# Altium schematic sheet charger.SchDoc
size A2; SheetNumber: 1; SheetTotal: 1
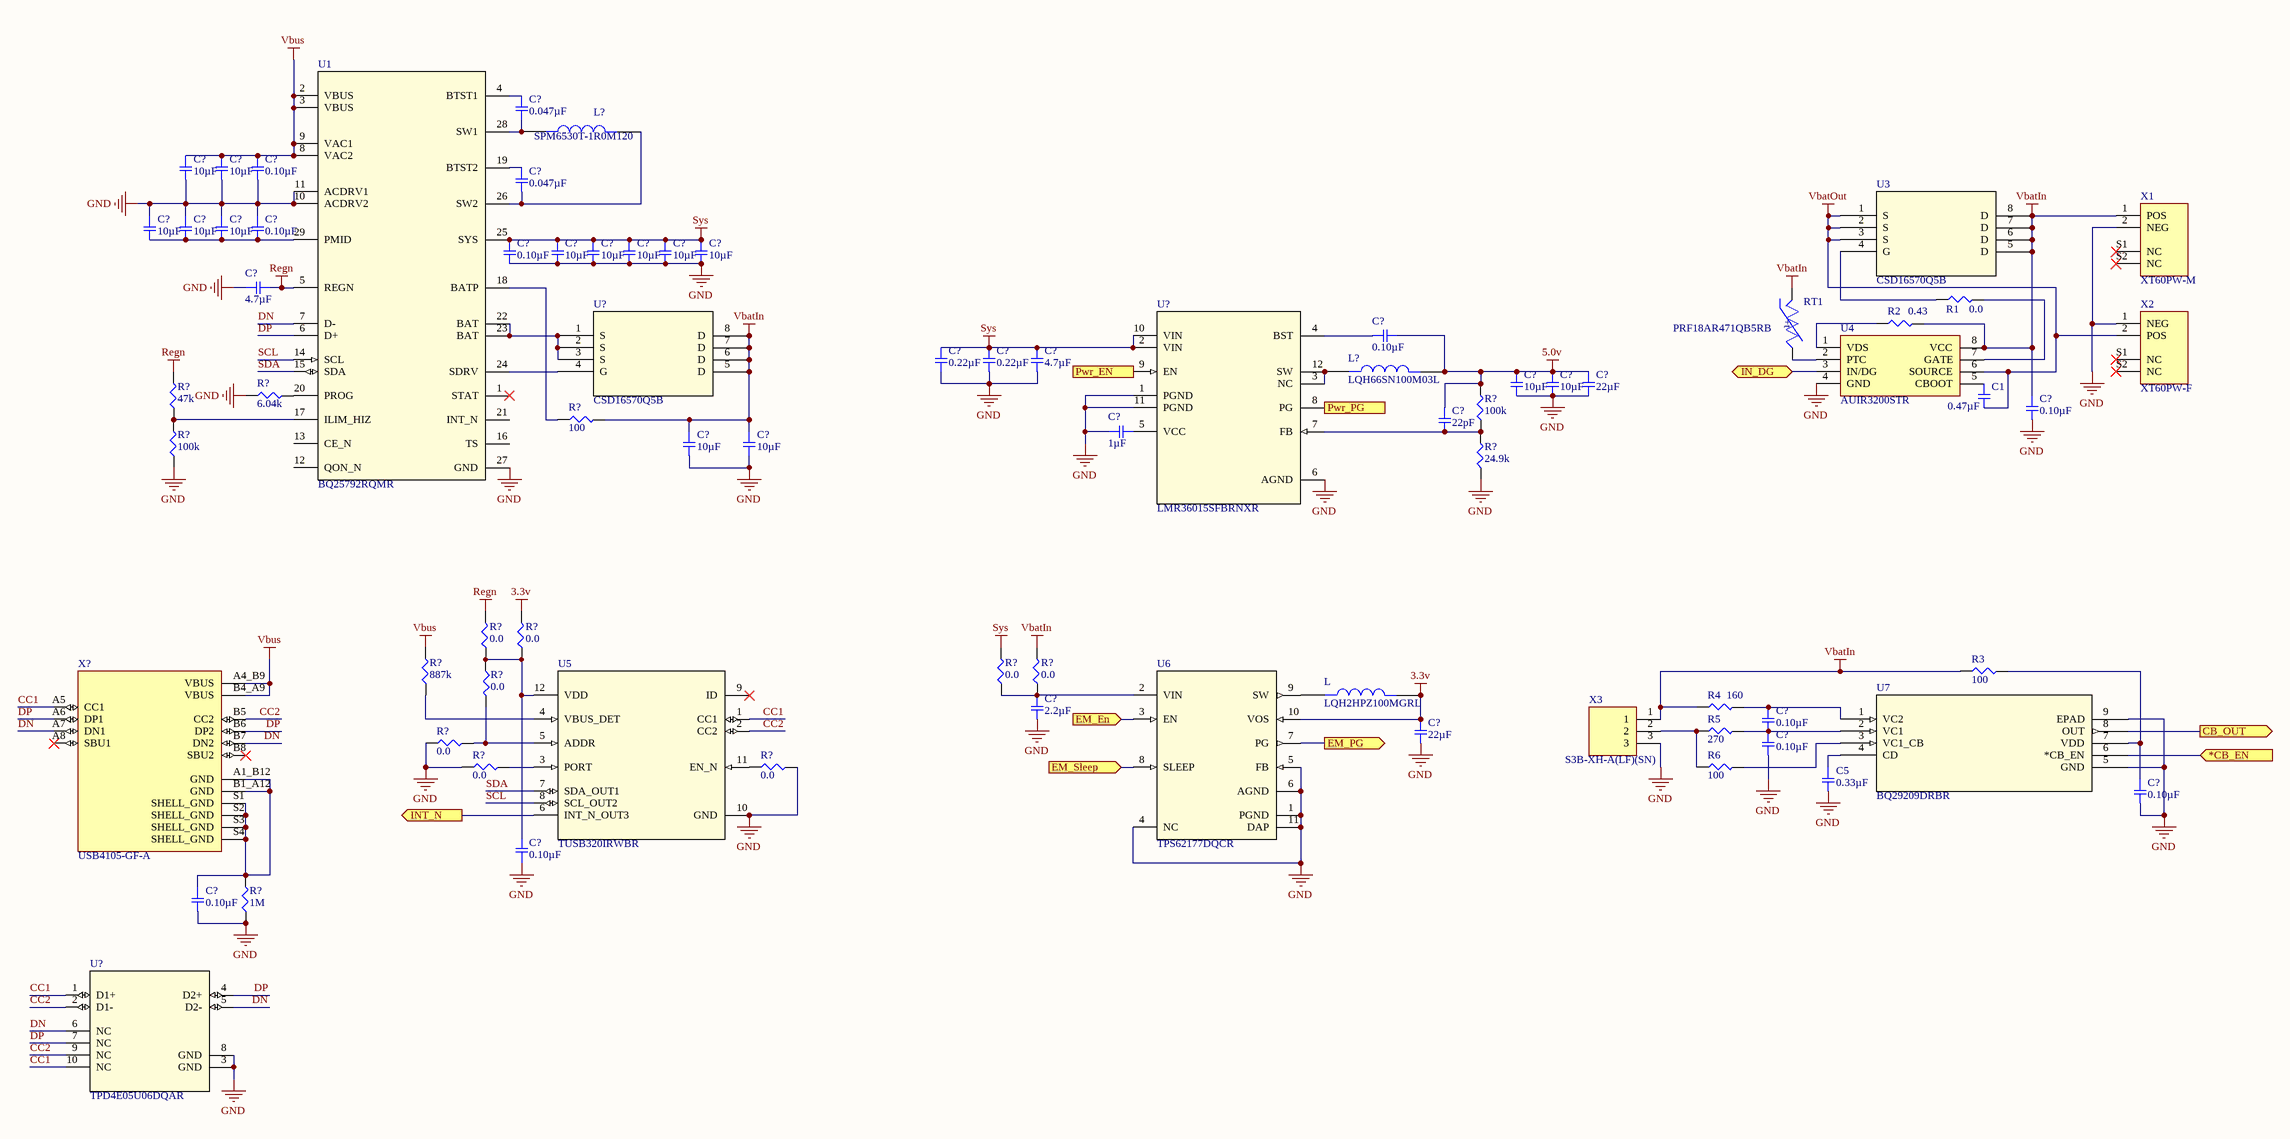
[diagram p0: charger.SchDoc]

## Parts
(Parts that share a designator on the sheet are numbered #1, #2 ... from top to bottom, then left to right.)
C1  0.47µF  [SMD-0603C]
C5  0.33µF  [SMD-0603C]
C?#1  0.047µF  [SMD-0402C]
C?#2  10µF  [SMD-0805C]
C?#3  10µF  [SMD-0805C]
C?#4  0.10µF  [SMD-0402C]
C?#5  0.047µF  [SMD-0402C]
C?#6  10µF  [SMD-0805C]
C?#7  10µF  [SMD-0805C]
C?#8  10µF  [SMD-0805C]
C?#9  0.10µF  [SMD-0402C]
C?#10  0.10µF  [SMD-0402C]
C?#11  10µF  [SMD-0805C]
C?#12  10µF  [SMD-0805C]
C?#13  10µF  [SMD-0805C]
C?#14  10µF  [SMD-0805C]
C?#15  10µF  [SMD-0805C]
C?#16  4.7µF  [SMD-0805C]
C?#17  0.10µF  [SMD-0402C]
C?#18  0.22µF  [SMD-0603C]
C?#19  0.22µF  [SMD-0603C]
C?#20  4.7µF  [SMD-0805C]
C?#21  10µF  [SMD-0805C]
C?#22  10µF  [SMD-0805C]
C?#23  22µF  [SMD-0805C]
C?#24  0.10µF  [SMD-0402C]
C?#25  22pF  [SMD-0402C]
C?#26  1µF  [SMD-0402C]
C?#27  10µF  [SMD-0805C]
C?#28  10µF  [SMD-0805C]
C?#29  2.2µF  [SMD-0805C]
C?#30  0.10µF  [SMD-0402C]
C?#31  22µF  [SMD-0805C]
C?#32  0.10µF  [SMD-0402C]
C?#33  0.10µF  [SMD-0402C]
C?#34  0.10µF  [SMD-0402C]
C?#35  0.10µF  [SMD-0402C]
L  LQH2HPZ100MGRL  [IND_LQH2HPZ100MGRL]
L?#1  SPM6530T-1R0M120  [SPM6530T-1R0M120]
L?#2  LQH66SN100M03L  [IND_LQH66SN100M03L]
R1  0.0  [SMD-0402-RES]
R2  0.43  [SMD-0402-RES]
R3  100  [SMD-0402-RES]
R4  160  [SMD-0402-RES]
R5  270  [SMD-0402-RES]
R6  100  [SMD-0402-RES]
R?#1  47k  [SMD-0402-RES]
R?#2  6.04k  [SMD-0402-RES]
R?#3  100k  [SMD-0402-RES]
R?#4  100  [SMD-0402-RES]
R?#5  100k  [SMD-0402-RES]
R?#6  24.9k  [SMD-0402-RES]
R?#7  0.0  [SMD-0402-RES]
R?#8  0.0  [SMD-0402-RES]
R?#9  887k  [SMD-0402-RES]
R?#10  0.0  [SMD-0402-RES]
R?#11  0.0  [SMD-0402-RES]
R?#12  0.0  [SMD-0402-RES]
R?#13  0.0  [SMD-0402-RES]
R?#14  0.0  [SMD-0402-RES]
R?#15  0.0  [SMD-0402-RES]
R?#16  1M  [SMD-0402-RES]
RT1  PRF18AR471QB5RB  [THRMC1608X95N]
U1  BQ25792RQMR  [RQM0029A-MFG]
U3  CSD16570Q5B  [DNK8]
U4  AUIR3200STR  [SOIC127P600X175-8N]
U5  TUSB320IRWBR  [RWB0012A]
U6  TPS62177DQCR  [DQC0010A]
U7  BQ29209DRBR  [DRB8_1P6X2P4]
U?#1  CSD16570Q5B  [DNK8]
U?#2  LMR36015SFBRNXR  [RNX0012B]
U?#3  TPD4E05U06DQAR  [DQA0010A]
X1  XT60PW-M  [XT60PW-M]
X2  XT60PW-F  [XT60PW-F]
X3  S3B-XH-A(LF)(SN)  [JST_S3B-XH-A(LF)(SN)]
X?  USB4105-GF-A  [GCT_USB4105-GF-A]

## Ports
*CB_EN (in), CB_OUT (out), EM_En (in), EM_PG (out), EM_Sleep (in), IN_DG (bidir), INT_N (out), Pwr_EN (in), Pwr_PG (out)

## Nets
3.3v: C?#31.1 L.2 R?#8.2 U6.10(VOS)
5.0v: C?#17.2 C?#21.1 C?#22.1 C?#23.1 C?#25.1 L?#2.2 R?#3.2
GND: C5.2 C?#2.2 C?#3.2 C?#4.2 C?#6.1 C?#7.1 C?#8.1 C?#9.1 C?#10.2 C?#11.2 C?#12.2 C?#13.2 C?#14.2 C?#15.2 C?#16.1 C?#18.2 C?#19.2 C?#20.2 C?#21.2 C?#22.2 C?#23.2 C?#24.2 C?#26.1 C?#27.2 C?#28.2 C?#29.2 C?#31.2 C?#32.2 C?#33.2 C?#34.1 C?#35.2 R?#2.1 R?#5.1 R?#6.1 R?#13.1 R?#14.1 R?#15.2 R?#16.1 U1.10(ACDRV2) U1.11(ACDRV1) U1.27(GND) U4.4(GND) U5.10(GND) U6.1(PGND) U6.4(NC) U6.5(FB) U6.6(AGND) U6.11(DAP) U7.5(GND) U7.9(EPAD) U?#2.1(PGND) U?#2.6(AGND) U?#2.11(PGND) U?#3.3(GND) U?#3.8(GND) X1.2(NEG) X2.1(NEG) X3.3
Regn: C?#16.2 R?#1.2 R?#7.2 U1.5(REGN)
Sys: C?#10.1 C?#11.1 C?#12.1 C?#13.1 C?#14.1 C?#15.1 C?#18.1 C?#19.1 C?#20.1 R?#10.2 U1.25(SYS) U?#2.2(VIN) U?#2.10(VIN)
VbatIn: C?#24.1 C?#27.1 C?#28.1 R2.2 R3.1 R4.1 R?#4.2 R?#11.2 RT1.1 U3.5(D) U3.6(D) U3.7(D) U3.8(D) U4.8(VCC) U?#1.5(D) U?#1.6(D) U?#1.7(D) U?#1.8(D) X1.1(POS) X3.1
VbatOut: C1.2 U3.1(S) U3.2(S) U3.3(S) U4.6(SOURCE) X2.2(POS)
Vbus: C?#2.1 C?#3.1 C?#4.1 R?#9.2 U1.2(VBUS) U1.3(VBUS) U1.8(VAC2) U1.9(VAC1) X?.A4_B9(VBUS) X?.B4_A9(VBUS)
*CB_EN: U7.6(*CB_EN) ; port *CB_EN
CB_OUT: U7.8(OUT) ; port CB_OUT
CC1: U5.1(CC1) U?#3.1(D1+) U?#3.10(NC) X?.A5(CC1)
CC2: U5.2(CC2) U?#3.2(D1-) U?#3.9(NC) X?.B5(CC2)
DN: U1.7(D-) U?#3.5(D2-) U?#3.6(NC) X?.A7(DN1) X?.B7(DN2)
DP: U1.6(D+) U?#3.4(D2+) U?#3.7(NC) X?.A6(DP1) X?.B6(DP2)
EM_En: U6.3(EN) ; port EM_En
EM_PG: U6.7(PG) ; port EM_PG
EM_Sleep: U6.8(SLEEP) ; port EM_Sleep
IN_DG: U4.3(IN/DG) ; port IN_DG
INT_N: U5.6(INT_N_OUT3) ; port INT_N
Pwr_EN: U?#2.9(EN) ; port Pwr_EN
Pwr_PG: U?#2.8(PG) ; port Pwr_PG
SCL: U1.14(SCL) U5.8(SCL_OUT2)
SDA: U1.15(SDA) U5.7(SDA_OUT1)
NetC1_1: C1.1 U4.5(CBOOT)
NetC5_1: C5.1 U7.4(CD)
NetC?#1_1: C?#1.1 U1.4(BTST1)
NetC?#1_2: C?#1.2 L?#1.1 U1.28(SW1)
NetC?#5_1: C?#5.1 U1.19(BTST2)
NetC?#5_2: C?#5.2 L?#1.2 U1.26(SW2)
NetC?#6_2: C?#6.2 C?#7.2 C?#8.2 C?#9.2 U1.29(PMID)
NetC?#17_1: C?#17.1 U?#2.4(BST)
NetC?#25_2: C?#25.2 R?#3.1 R?#6.2 U?#2.7(FB)
NetC?#26_2: C?#26.2 U?#2.5(VCC)
NetC?#29_1: C?#29.1 R?#10.1 R?#11.1 U6.2(VIN)
NetC?#30_1: C?#30.1 R4.2 U7.1(VC2)
NetC?#30_2: C?#30.2 C?#32.1 R5.2 U7.2(VC1)
NetC?#33_1: C?#33.1 R3.2 U7.7(VDD)
NetC?#34_2: C?#34.2 R?#7.1 R?#8.1 R?#12.1 U5.12(VDD)
NetC?#35_1: C?#35.1 R?#16.2 X?.A1_B12(GND) X?.B1_A12(GND) X?.S1(SHELL_GND) X?.S2(SHELL_GND) X?.S3(SHELL_GND) X?.S4(SHELL_GND)
NetL?#2_1: L?#2.1 U?#2.3(NC) U?#2.12(SW)
NetL_1: L.1 U6.9(SW)
NetR1_1: R1.1 U3.4(G)
NetR1_2: R1.2 U4.7(GATE)
NetR2_1: R2.1 U4.1(VDS)
NetR5_1: R5.1 R6.1 X3.2
NetR6_2: R6.2 U7.3(VC1_CB)
NetR?#1_1: R?#1.1 R?#5.2 U1.17(ILIM_HIZ)
NetR?#2_2: R?#2.2 U1.20(PROG)
NetR?#4_1: R?#4.1 U1.18(BATP)
NetR?#9_1: R?#9.1 U5.4(VBUS_DET)
NetR?#12_2: R?#12.2 R?#13.2 U5.5(ADDR)
NetR?#14_2: R?#14.2 U5.3(PORT)
NetR?#15_1: R?#15.1 U5.11(EN_N)
NetRT1_2: RT1.2 U4.2(PTC)
NetU1_22: U1.22(BAT) U1.23(BAT) U?#1.1(S) U?#1.2(S) U?#1.3(S)
NetU1_24: U1.24(SDRV) U?#1.4(G)

Not connected (* = marked no-connect by the designer): U1 1(STAT)* 12(QON_N) 13(CE_N) 16(TS) 21(INT_N); U5 9(ID)*; X1 S1(NC)* S2(NC)*; X2 S1(NC)* S2(NC)*; X? A8(SBU1)* B8(SBU2)*

## Notes on the sheet
- (in symbol PRF18AR471QB5RB) +t

## Library data of the parts
C1 = GCM188R71C474KA55D: C=10*(Qg max / Vgs) / Vgs = const = 6v / for CSD16570Q5B Qg max = 250nC / 10*250/6 = 417; Manufacturer: Murata Electronics North America; Factory Stock: 0; Unit Price (USD): 0.12; Minimum Quantity: 1; Tolerance: ±10%; Voltage: 16V; Temperature Coefficient: X7R; Datasheets: http://www.murata.com/~/media/webrenewal/support/library/catalog/products/capacitor/mlcc/c03e.ashx; Image: //media.digikey.com/Renders/Murata%20Renders/0603%28GCM188%29.jpg; Digi-Key Part Number: 490-4775-1-ND; Part Number: GCM188R71C474KA55D; Quantity Available: 73764; @ qty: 0; Packaging: Cut Tape (CT); Series: GCM; Part Status: Active; Value: 0.47µF; Operating Temperature: -55°C ~ 125°C; Features: -; Ratings: AEC-Q200; Applications: Automotive; Mounting Type: Surface Mount, MLCC; Package / Case: 0603 (1608 Metric); Size / Dimension: 0.063" L x 0.031" W (1.60mm x 0.80mm); Height - Seated (Max): -; Thickness (Max): 0.035" (0.90mm); Lead Spacing: -; Lead Style: -
C5 = GCM188R71C334KA37D: CAP CER 0.33UF 16V X7R 0603; Manufacturer: Murata Electronics North America; Factory Stock: 0; Unit Price (USD): 0.19; Minimum Quantity: 1; Tolerance: ±10%; Datasheets: http://www.murata.com/~/media/webrenewal/support/library/catalog/products/capacitor/mlcc/c03e.ashx; Image: //media.digikey.com/Renders/Murata%20Renders/0603%28GCM188%29.jpg; Digi-Key Part Number: 490-6050-1-ND; Part Number: GCM188R71C334KA37D; Quantity Available: 10234; @ qty: 0; Packaging: Cut Tape (CT); Series: GCM; Part Status: Active; Value: 0.33µF; Voltage: 16V; Temperature Coefficient: X7R; Operating Temperature: -55°C ~ 125°C; Features: -; Ratings: AEC-Q200; Applications: Automotive; Mounting Type: Surface Mount, MLCC; Package / Case: 0603 (1608 Metric); Size / Dimension: 0.063" L x 0.031" W (1.60mm x 0.80mm); Height - Seated (Max): -; Thickness (Max): 0.035" (0.90mm); Lead Spacing: -; Lead Style: -
C?#1 C?#5 = GRM155R61H473KE19D: CAP CER 0.047UF 50V X5R 0402; Manufacturer: Murata Electronics North America; Factory Stock: 0; Unit Price (USD): 0.1; Minimum Quantity: 1; Tolerance: ±10%; Datasheets: http://www.murata.com/~/media/webrenewal/support/library/catalog/products/capacitor/mlcc/c02e.pdf; Image: //media.digikey.com/Renders/Murata%20Renders/ZRB-SERIES-0402.jpg; Digi-Key Part Number: 490-12705-1-ND; Part Number: GRM155R61H473KE19D; Quantity Available: 2015; @ qty: 0; Packaging: Cut Tape (CT); Series: GRM; Part Status: Active; Value: 0.047µF; Voltage: 50V; Temperature Coefficient: X5R; Operating Temperature: -55°C ~ 85°C; Features: -; Ratings: -; Applications: General Purpose; Mounting Type: Surface Mount, MLCC; Package / Case: 0402 (1005 Metric); Size / Dimension: 0.039" L x 0.020" W (1.00mm x 0.50mm); Height - Seated (Max): -; Thickness (Max): 0.022" (0.55mm); Lead Spacing: -; Lead Style: -
C?#2 C?#3 C?#6-C?#8 C?#11-C?#15 C?#27 C?#28 = GRM21BR6YA106KE43L: CAP CER 10UF 35V X5R 0805; Manufacturer: Murata Electronics North America; Factory Stock: 0; Unit Price (USD): 0.33; Minimum Quantity: 1; Tolerance: ±10%; Datasheets: http://www.murata.com/~/media/webrenewal/support/library/catalog/products/capacitor/mlcc/c02e.pdf; Image: //media.digikey.com/Renders/Murata%20Renders/0805%20(2012%20Metric)%20.85mm.jpg; Digi-Key Part Number: 490-10514-1-ND; Part Number: GRM21BR6YA106KE43L; Quantity Available: 23781; @ qty: 0; Packaging: Cut Tape (CT); Series: GRM; Part Status: Active; Value: 10µF; Voltage: 35V; Temperature Coefficient: X5R; Operating Temperature: -55°C ~ 85°C; Features: Derating Recommended; Ratings: -; Applications: General Purpose; Mounting Type: Surface Mount, MLCC; Package / Case: 0805 (2012 Metric); Size / Dimension: 0.079" L x 0.049" W (2.00mm x 1.25mm); Height - Seated (Max): -; Thickness (Max): 0.057" (1.45mm); Lead Spacing: -; Lead Style: -
C?#4 C?#9 C?#10 C?#34 C?#35 = GRM155R61H104KE19D: CAP CER 0.1UF 50V X5R 0402; Manufacturer: Murata Electronics North America; Factory Stock: 0; Unit Price (USD): 0.1; Minimum Quantity: 1; Tolerance: ±10%; Datasheets: http://www.murata.com/~/media/webrenewal/support/library/catalog/products/capacitor/mlcc/c02e.pdf; Image: //media.digikey.com/Renders/Murata%20Renders/ZRB-SERIES-0402.jpg; Digi-Key Part Number: 490-11917-1-ND; Part Number: GRM155R61H104KE19D; Quantity Available: 627409; @ qty: 0; Packaging: Cut Tape (CT); Series: GRM; Part Status: Active; Value: 0.10µF; Voltage: 50V; Temperature Coefficient: X5R; Operating Temperature: -55°C ~ 85°C; Features: -; Ratings: -; Applications: General Purpose; Mounting Type: Surface Mount, MLCC; Package / Case: 0402 (1005 Metric); Size / Dimension: 0.039" L x 0.020" W (1.00mm x 0.50mm); Height - Seated (Max): -; Thickness (Max): 0.022" (0.55mm); Lead Spacing: -; Lead Style: -
C?#16 C?#20 = GRM21BR61H475KE51L: CAP CER 4.7UF 50V X5R 0805; Manufacturer: Murata Electronics North America; Factory Stock: 0; Unit Price (USD): 0.37; Minimum Quantity: 1; Tolerance: ±10%; Datasheets: http://www.murata.com/~/media/webrenewal/support/library/catalog/products/capacitor/mlcc/c02e.pdf; Image: //media.digikey.com/Renders/Murata%20Renders/0805%20(2012%20Metric)%20.85mm.jpg; Digi-Key Part Number: 490-10751-1-ND; Part Number: GRM21BR61H475KE51L; Quantity Available: 29522; @ qty: 0; Packaging: Cut Tape (CT); Series: GRM; Part Status: Active; Value: 4.7µF; Voltage: 50V; Temperature Coefficient: X5R; Operating Temperature: -55°C ~ 85°C; Features: -; Ratings: -; Applications: General Purpose; Mounting Type: Surface Mount, MLCC; Package / Case: 0805 (2012 Metric); Size / Dimension: 0.079" L x 0.049" W (2.00mm x 1.25mm); Height - Seated (Max): -; Thickness (Max): 0.055" (1.40mm); Lead Spacing: -; Lead Style: -
C?#17 C?#24 C?#30 C?#32 C?#33 = GRM155R71H104ME14D: CAP CER 0.1UF 50V X7R 0402; Manufacturer: Murata Electronics North America; Factory Stock: 0; Unit Price (USD): 0.1; Minimum Quantity: 1; Tolerance: ±20%; Datasheets: http://www.murata.com/~/media/webrenewal/support/library/catalog/products/capacitor/mlcc/c02e.pdf; Image: //media.digikey.com/Renders/Murata%20Renders/ZRB-SERIES-0402.jpg; Digi-Key Part Number: 490-10701-1-ND; Part Number: GRM155R71H104ME14D; Quantity Available: 148884; @ qty: 0; Packaging: Cut Tape (CT); Series: GRM; Part Status: Active; Value: 0.10µF; Voltage: 50V; Temperature Coefficient: X7R; Operating Temperature: -55°C ~ 125°C; Features: -; Ratings: -; Applications: General Purpose; Mounting Type: Surface Mount, MLCC; Package / Case: 0402 (1005 Metric); Size / Dimension: 0.039" L x 0.020" W (1.00mm x 0.50mm); Height - Seated (Max): -; Thickness (Max): 0.022" (0.55mm); Lead Spacing: -; Lead Style: -
C?#18 C?#19 = GRM188R61H224KAC4D: CAP CER 0.22UF 50V X5R 0603; Manufacturer: Murata Electronics North America; Factory Stock: 0; Unit Price (USD): 0.2; Minimum Quantity: 1; Tolerance: ±10%; Datasheets: -; Image: //media.digikey.com/Renders/Murata%20Renders/ZRB-SERIES-0402.jpg; Digi-Key Part Number: 490-12739-1-ND; Part Number: GRM188R61H224KAC4D; Quantity Available: 489; @ qty: 0; Packaging: Cut Tape (CT); Series: GRM; Part Status: Active; Value: 0.22µF; Voltage: 50V; Temperature Coefficient: X5R; Operating Temperature: -55°C ~ 85°C; Features: -; Ratings: -; Applications: General Purpose; Mounting Type: Surface Mount, MLCC; Package / Case: 0603 (1608 Metric); Size / Dimension: 0.063" L x 0.031" W (1.60mm x 0.80mm); Height - Seated (Max): -; Thickness (Max): 0.035" (0.90mm); Lead Spacing: -; Lead Style: -
C?#21 C?#22 = GRM219R61A106KE44D: CAP CER 10UF 10V X5R 0805; Manufacturer: Murata Electronics North America; Factory Stock: 0; Unit Price (USD): 0.18; Minimum Quantity: 1; Tolerance: ±10%; Datasheets: http://www.murata.com/~/media/webrenewal/support/library/catalog/products/capacitor/mlcc/c02e.pdf; Image: //media.digikey.com/Renders/Murata%20Renders/0805%20(2012%20Metric)%20.85mm.jpg; Digi-Key Part Number: 490-4735-1-ND; Part Number: GRM219R61A106KE44D; Quantity Available: 31530; @ qty: 0; Packaging: Cut Tape (CT); Series: GRM; Part Status: Active; Value: 10µF; Voltage: 10V; Temperature Coefficient: X5R; Operating Temperature: -55°C ~ 85°C; Features: -; Ratings: -; Applications: General Purpose; Mounting Type: Surface Mount, MLCC; Package / Case: 0805 (2012 Metric); Size / Dimension: 0.079" L x 0.049" W (2.00mm x 1.25mm); Height - Seated (Max): -; Thickness (Max): 0.037" (0.95mm); Lead Spacing: -; Lead Style: -
C?#23 = GRM219R61A226MEA0D: CAP CER 22UF 10V X5R 0805; Manufacturer: Murata Electronics North America; Factory Stock: 0; Unit Price (USD): 0.4; Minimum Quantity: 1; Tolerance: ±20%; Datasheets: http://www.murata.com/~/media/webrenewal/support/library/catalog/products/capacitor/mlcc/c02e.pdf; Image: //media.digikey.com/Renders/Murata%20Renders/0805%20(2012%20Metric)%20.85mm.jpg; Digi-Key Part Number: 490-9951-1-ND; Part Number: GRM219R61A226MEA0D; Quantity Available: 179544; @ qty: 0; Packaging: Cut Tape (CT); Series: GRM; Part Status: Active; Value: 22µF; Voltage: 10V; Temperature Coefficient: X5R; Operating Temperature: -55°C ~ 85°C; Features: Derating Recommended; Ratings: -; Applications: General Purpose; Mounting Type: Surface Mount, MLCC; Package / Case: 0805 (2012 Metric); Size / Dimension: 0.079" L x 0.049" W (2.00mm x 1.25mm); Height - Seated (Max): -; Thickness (Max): 0.037" (0.95mm); Lead Spacing: -; Lead Style: -
C?#25 = GCM1555C1H220JA16D: CAP CER 22PF 50V NP0 0402; Manufacturer: Murata Electronics North America; Factory Stock: 0; Unit Price (USD): 0.1; Minimum Quantity: 1; Tolerance: ±5%; Temperature Coefficient: C0G, NP0; Datasheets: http://www.murata.com/~/media/webrenewal/support/library/catalog/products/capacitor/mlcc/c03e.ashx; Image: //media.digikey.com/Renders/Murata%20Renders/ZRB-SERIES-0402.jpg; Digi-Key Part Number: 490-9648-1-ND; Part Number: GCM1555C1H220JA16D; Quantity Available: 26532; @ qty: 0; Packaging: Cut Tape (CT); Series: GCM; Part Status: Active; Value: 22pF; Voltage: 50V; Operating Temperature: -55°C ~ 125°C; Features: -; Ratings: AEC-Q200; Applications: Automotive; Mounting Type: Surface Mount, MLCC; Package / Case: 0402 (1005 Metric); Size / Dimension: 0.039" L x 0.020" W (1.00mm x 0.50mm); Height - Seated (Max): -; Thickness (Max): 0.022" (0.55mm); Lead Spacing: -; Lead Style: -
C?#26 = GRM155R61A105KE01D: CAP CER 1UF 10V X5R 0402; Manufacturer: Murata Electronics North America; Factory Stock: 0; Unit Price (USD): 0.1; Minimum Quantity: 1; Tolerance: ±10%; Datasheets: http://www.murata.com/~/media/webrenewal/support/library/catalog/products/capacitor/mlcc/c02e.pdf; Image: //media.digikey.com/Renders/Murata%20Renders/ZRB-SERIES-0402.jpg; Digi-Key Part Number: 490-12701-1-ND; Part Number: GRM155R61A105KE01D; Quantity Available: 19750; @ qty: 0; Packaging: Cut Tape (CT); Series: GRM; Part Status: Active; Value: 1µF; Voltage: 10V; Temperature Coefficient: X5R; Operating Temperature: -55°C ~ 85°C; Features: -; Ratings: -; Applications: General Purpose; Mounting Type: Surface Mount, MLCC; Package / Case: 0402 (1005 Metric); Size / Dimension: 0.039" L x 0.020" W (1.00mm x 0.50mm); Height - Seated (Max): -; Thickness (Max): 0.022" (0.55mm); Lead Spacing: -; Lead Style: -
C?#29 = GRM219R61H225KE15D: CAP CER 2.2UF 50V X5R 0805; Manufacturer: Murata Electronics North America; Factory Stock: 0; Unit Price (USD): 0.2; Minimum Quantity: 1; Tolerance: ±10%; Datasheets: http://www.murata.com/~/media/webrenewal/support/library/catalog/products/capacitor/mlcc/c02e.pdf; Image: //media.digikey.com/Renders/Murata%20Renders/0805%20(2012%20Metric)%20.85mm.jpg; Digi-Key Part Number: 490-10744-1-ND; Part Number: GRM219R61H225KE15D; Quantity Available: 35924; @ qty: 0; Packaging: Cut Tape (CT); Series: GRM; Part Status: Active; Value: 2.2µF; Voltage: 50V; Temperature Coefficient: X5R; Operating Temperature: -55°C ~ 85°C; Features: -; Ratings: -; Applications: General Purpose; Mounting Type: Surface Mount, MLCC; Package / Case: 0805 (2012 Metric); Size / Dimension: 0.079" L x 0.049" W (2.00mm x 1.25mm); Height - Seated (Max): -; Thickness (Max): 0.037" (0.95mm); Lead Spacing: -; Lead Style: -
C?#31 = GRM219R60J226ME47D: CAP CER 22UF 6.3V X5R 0805; Manufacturer: Murata Electronics North America; Factory Stock: 0; Unit Price (USD): 0.32; Minimum Quantity: 1; Tolerance: ±20%; Datasheets: http://www.murata.com/~/media/webrenewal/support/library/catalog/products/capacitor/mlcc/c02e.pdf; Image: //media.digikey.com/Renders/Murata%20Renders/0805%20(2012%20Metric)%20.85mm.jpg; Digi-Key Part Number: 490-9950-1-ND; Part Number: GRM219R60J226ME47D; Quantity Available: 12330; @ qty: 0; Packaging: Cut Tape (CT); Series: GRM; Part Status: Active; Value: 22µF; Voltage: 6.3V; Temperature Coefficient: X5R; Operating Temperature: -55°C ~ 85°C; Features: Derating Recommended; Ratings: -; Applications: General Purpose; Mounting Type: Surface Mount, MLCC; Package / Case: 0805 (2012 Metric); Size / Dimension: 0.079" L x 0.049" W (2.00mm x 1.25mm); Height - Seated (Max): -; Thickness (Max): 0.037" (0.95mm); Lead Spacing: -; Lead Style: -
L = LQH2HPZ100MGRL: Inductor with Inductance: 10uH Tol. +/-20%, Package: 1008 _2520_; MF: Murata; Value: *; Package: NONSTANDARD; SnapEDA_Link: https://www.snapeda.com/parts/LQH2HPZ100MGRL/Murata/view-part/1498264/?ref=snap; MP: LQH2HPZ100MGRL
L?#1 = SPM6530T-1R0M120: 1.0µH Shielded Wirewound Inductor 1.0uH 0.0071ohms 7.1x6.5x3mm; MP: LQH2HPN100MJRL; Package: None; Price: None; Value: *; Availability: Unavailable
L?#2 = LQH66SN100M03L: Ð˜Ð½Ð´ÑƒÐºÑ‚Ð¾Ñ€ Ñ Ð¸Ð½Ð´ÑƒÐºÑ‚Ð¸Ð²Ð½Ð¾ÑÑ‚ÑŒÑŽ: 10uH Tol. +/- 20%, Ð£Ð¿Ð°ÐºÐ¾Ð²ÐºÐ°: 2525 (6363); MF: Murata; Value: *; Check_prices: https://www.snapeda.com/parts/LQH66SN100M03L/Murata/view-part/4550275/?ref=eda; Availability: Good; Price: None; MP: LQH66SN100M03L; Package: NONSTANDARD; Purchase-URL: https://pricing.snapeda.com/search/part/LQH66SN100M03L/?ref=eda; SnapEDA_Link: https://www.snapeda.com/parts/LQH66SN100M03L/Murata/view-part/4550275/?ref=snap
R1 R?#7 R?#8 R?#10-R?#15 = ERJ-2GE0R00X: RES SMD 0.0OHM JUMPER 1/10W 0402; Manufacturer: Panasonic Electronic Components; Factory Stock: 0; Unit Price (USD): 0.00384; @ qty: 1500; Minimum Quantity: 1; Power (Watts): 0.1W, 1/10W; Part Number: ERJ-2GE0R00X; Datasheets: http://industrial.panasonic.com/www-cgi/jvcr13pz.cgi?E+PZ+3+AOA0001+ERJ2GE0R00X+7+WW; Image: //media.digikey.com/Photos/Panasonic%20Photos/ERJ-PA2-Series.jpg; Digi-Key Part Number: P0.0JCT-ND; Quantity Available: 3152483; Packaging: Cut Tape (CT); Series: ERJ; Part Status: Active; Value: 0.0; Tolerance: Jumper; Composition: Thick Film; Features: Automotive AEC-Q200; Temperature Coefficient: -; Operating Temperature: -55°C ~ 155°C; Package / Case: 0402 (1005 Metric); Supplier Device Package: 0402; Size / Dimension: 0.039" L x 0.020" W (1.00mm x 0.50mm); Height - Seated (Max): 0.016" (0.40mm); Number of Terminations: 2; Failure Rate: -
R2 = ERJ-2BQFR43X: RES SMD 0.43 OHM 1% 1/6W 0402; Manufacturer: Panasonic Electronic Components; Factory Stock: 0; Unit Price (USD): 0.10080; @ qty: 1500; Minimum Quantity: 1; Power (Watts): 0.167W, 1/6W; Temperature Coefficient: ±250ppm/°C; Part Number: ERJ-2BQFR43X; Datasheets: https://industrial.panasonic.com/cdbs/www-data/pdf/RDA0000/AOA0000C239.pdf; Image: //media.digikey.com/Photos/Panasonic%20Photos/ERJ-PA2-Series.jpg; Digi-Key Part Number: P.43AKCT-ND; Quantity Available: 26414; Packaging: Cut Tape (CT); Series: ERJ; Part Status: Active; Value: 0.43; Tolerance: ±1%; Composition: Thick Film; Features: Automotive AEC-Q200, Current Sense; Operating Temperature: -55°C ~ 125°C; Package / Case: 0402 (1005 Metric); Supplier Device Package: 0402; Size / Dimension: 0.039" L x 0.020" W (1.00mm x 0.50mm); Height - Seated (Max): 0.016" (0.40mm); Number of Terminations: 2; Failure Rate: -
R3 R6 = ERJ-2GEJ101X: RES SMD 100 OHM 5% 1/10W 0402; Manufacturer: Panasonic Electronic Components; Factory Stock: 0; Unit Price (USD): 0.00350; @ qty: 1500; Minimum Quantity: 1; Power (Watts): 0.1W, 1/10W; Temperature Coefficient: ±200ppm/°C; Part Number: ERJ-2GEJ101X; Datasheets: http://industrial.panasonic.com/www-cgi/jvcr13pz.cgi?E+PZ+3+AOA0001+ERJ2GEJ101X+7+WW; Image: //media.digikey.com/Photos/Panasonic%20Photos/ERJ-PA2-Series.jpg; Digi-Key Part Number: P100JCT-ND; Quantity Available: 3114113; Packaging: Cut Tape (CT); Series: ERJ; Part Status: Active; Value: 100; Tolerance: ±5%; Composition: Thick Film; Features: Automotive AEC-Q200; Operating Temperature: -55°C ~ 155°C; Package / Case: 0402 (1005 Metric); Supplier Device Package: 0402; Size / Dimension: 0.039" L x 0.020" W (1.00mm x 0.50mm); Height - Seated (Max): 0.016" (0.40mm); Number of Terminations: 2; Failure Rate: -
R4 = ERJ-2GEJ161X: RES SMD 160 OHM 5% 1/10W 0402; Manufacturer: Panasonic Electronic Components; Factory Stock: 0; Unit Price (USD): 0.00350; @ qty: 1500; Minimum Quantity: 1; Power (Watts): 0.1W, 1/10W; Temperature Coefficient: ±200ppm/°C; Part Number: ERJ-2GEJ161X; Datasheets: http://industrial.panasonic.com/www-cgi/jvcr13pz.cgi?E+PZ+3+AOA0001+ERJ2GEJ161X+7+WW; Image: //media.digikey.com/Photos/Panasonic%20Photos/ERJ-PA2-Series.jpg; Digi-Key Part Number: P160JCT-ND; Quantity Available: 103224; Packaging: Cut Tape (CT); Series: ERJ; Part Status: Active; Value: 160; Tolerance: ±5%; Composition: Thick Film; Features: Automotive AEC-Q200; Operating Temperature: -55°C ~ 155°C; Package / Case: 0402 (1005 Metric); Supplier Device Package: 0402; Size / Dimension: 0.039" L x 0.020" W (1.00mm x 0.50mm); Height - Seated (Max): 0.016" (0.40mm); Number of Terminations: 2; Failure Rate: -
R5 = ERJ-2GEJ271X: RES SMD 270 OHM 5% 1/10W 0402; Manufacturer: Panasonic Electronic Components; Factory Stock: 0; Unit Price (USD): 0.00350; @ qty: 1500; Minimum Quantity: 1; Power (Watts): 0.1W, 1/10W; Temperature Coefficient: ±200ppm/°C; Part Number: ERJ-2GEJ271X; Datasheets: http://industrial.panasonic.com/www-cgi/jvcr13pz.cgi?E+PZ+3+AOA0001+ERJ2GEJ271X+7+WW; Image: //media.digikey.com/Photos/Panasonic%20Photos/ERJ-PA2-Series.jpg; Digi-Key Part Number: P270JCT-ND; Quantity Available: 86444; Packaging: Cut Tape (CT); Series: ERJ; Part Status: Active; Value: 270; Tolerance: ±5%; Composition: Thick Film; Features: Automotive AEC-Q200; Operating Temperature: -55°C ~ 155°C; Package / Case: 0402 (1005 Metric); Supplier Device Package: 0402; Size / Dimension: 0.039" L x 0.020" W (1.00mm x 0.50mm); Height - Seated (Max): 0.016" (0.40mm); Number of Terminations: 2; Failure Rate: -
R?#1 = ERJ-2RKF4702X: RES SMD 47K OHM 1% 1/10W 0402; Manufacturer: Panasonic Electronic Components; Factory Stock: 0; Unit Price (USD): 0.00496; @ qty: 1500; Minimum Quantity: 1; Power (Watts): 0.1W, 1/10W; Temperature Coefficient: ±100ppm/°C; Part Number: ERJ-2RKF4702X; Datasheets: http://industrial.panasonic.com/www-cgi/jvcr13pz.cgi?E+PZ+3+AOA0002+ERJ2RKF4702X+7+WW; Image: //media.digikey.com/Photos/Panasonic%20Photos/ERJ-PA2-Series.jpg; Digi-Key Part Number: P47.0KLCT-ND; Quantity Available: 230515; Packaging: Cut Tape (CT); Series: ERJ; Part Status: Active; Value: 47k; Tolerance: ±1%; Composition: Thick Film; Features: Automotive AEC-Q200; Operating Temperature: -55°C ~ 155°C; Package / Case: 0402 (1005 Metric); Supplier Device Package: 0402; Size / Dimension: 0.039" L x 0.020" W (1.00mm x 0.50mm); Height - Seated (Max): 0.016" (0.40mm); Number of Terminations: 2; Failure Rate: -
R?#2 = ERJ-2RKF6041X: RES SMD 6.04K OHM 1% 1/10W 0402; Manufacturer: Panasonic Electronic Components; Factory Stock: 0; Unit Price (USD): 0.00496; @ qty: 1500; Minimum Quantity: 1; Power (Watts): 0.1W, 1/10W; Temperature Coefficient: ±100ppm/°C; Part Number: ERJ-2RKF6041X; Datasheets: http://industrial.panasonic.com/www-cgi/jvcr13pz.cgi?E+PZ+3+AOA0002+ERJ2RKF6041X+7+WW; Image: //media.digikey.com/Photos/Panasonic%20Photos/ERJ-PA2-Series.jpg; Digi-Key Part Number: P6.04KLCT-ND; Quantity Available: 368877; Packaging: Cut Tape (CT); Series: ERJ; Part Status: Active; Value: 6.04k; Tolerance: ±1%; Composition: Thick Film; Features: Automotive AEC-Q200; Operating Temperature: -55°C ~ 155°C; Package / Case: 0402 (1005 Metric); Supplier Device Package: 0402; Size / Dimension: 0.039" L x 0.020" W (1.00mm x 0.50mm); Height - Seated (Max): 0.016" (0.40mm); Number of Terminations: 2; Failure Rate: -
R?#3 R?#5 = ERJ-2RKF1003X: RES SMD 100K OHM 1% 1/10W 0402; Manufacturer: Panasonic Electronic Components; Factory Stock: 0; Unit Price (USD): 0.00496; @ qty: 1500; Minimum Quantity: 1; Power (Watts): 0.1W, 1/10W; Temperature Coefficient: ±100ppm/°C; Part Number: ERJ-2RKF1003X; Datasheets: http://industrial.panasonic.com/www-cgi/jvcr13pz.cgi?E+PZ+3+AOA0002+ERJ2RKF1003X+7+WW; Image: //media.digikey.com/Photos/Panasonic%20Photos/ERJ-PA2-Series.jpg; Digi-Key Part Number: P100KLCT-ND; Quantity Available: 2645965; Packaging: Cut Tape (CT); Series: ERJ; Part Status: Active; Value: 100k; Tolerance: ±1%; Composition: Thick Film; Features: Automotive AEC-Q200; Operating Temperature: -55°C ~ 155°C; Package / Case: 0402 (1005 Metric); Supplier Device Package: 0402; Size / Dimension: 0.039" L x 0.020" W (1.00mm x 0.50mm); Height - Seated (Max): 0.016" (0.40mm); Number of Terminations: 2; Failure Rate: -
R?#4 = ERJ-PA2J101X: RES SMD 100 OHM 5% 1/5W 0402; Manufacturer: Panasonic Electronic Components; Factory Stock: 0; Unit Price (USD): 0.02020; @ qty: 1500; Minimum Quantity: 1; Power (Watts): 0.2W, 1/5W; Temperature Coefficient: ±200ppm/°C; Part Number: ERJ-PA2J101X; Datasheets: https://industrial.panasonic.com/cdbs/www-data/pdf/RDA0000/AOA0000C243.pdf; Image: //media.digikey.com/Photos/Panasonic%20Photos/ERJ-PA2-Series.jpg; Digi-Key Part Number: P17187CT-ND; Quantity Available: 11052; Packaging: Cut Tape (CT); Series: ERJ; Part Status: Active; Value: 100; Tolerance: ±5%; Composition: Thick Film; Features: Automotive AEC-Q200, Pulse Withstanding; Operating Temperature: -55°C ~ 155°C; Package / Case: 0402 (1005 Metric); Supplier Device Package: 0402; Size / Dimension: 0.039" L x 0.020" W (1.00mm x 0.50mm); Height - Seated (Max): 0.016" (0.40mm); Number of Terminations: 2; Failure Rate: -
R?#6 = ERJ-2RKF2492X: RES SMD 24.9K OHM 1% 1/10W 0402; Manufacturer: Panasonic Electronic Components; Factory Stock: 0; Unit Price (USD): 0.00496; @ qty: 1500; Minimum Quantity: 1; Power (Watts): 0.1W, 1/10W; Temperature Coefficient: ±100ppm/°C; Part Number: ERJ-2RKF2492X; Datasheets: http://industrial.panasonic.com/www-cgi/jvcr13pz.cgi?E+PZ+3+AOA0002+ERJ2RKF2492X+7+WW; Image: //media.digikey.com/Photos/Panasonic%20Photos/ERJ-PA2-Series.jpg; Digi-Key Part Number: P24.9KLCT-ND; Quantity Available: 116711; Packaging: Cut Tape (CT); Series: ERJ; Part Status: Active; Value: 24.9k; Tolerance: ±1%; Composition: Thick Film; Features: Automotive AEC-Q200; Operating Temperature: -55°C ~ 155°C; Package / Case: 0402 (1005 Metric); Supplier Device Package: 0402; Size / Dimension: 0.039" L x 0.020" W (1.00mm x 0.50mm); Height - Seated (Max): 0.016" (0.40mm); Number of Terminations: 2; Failure Rate: -
R?#9 = ERJ-2RKF8873X: RES SMD 887K OHM 1% 1/10W 0402; Manufacturer: Panasonic Electronic Components; Factory Stock: 0; Unit Price (USD): 0.00408; @ qty: 1500; Minimum Quantity: 1; Power (Watts): 0.1W, 1/10W; Temperature Coefficient: ±100ppm/°C; Part Number: ERJ-2RKF8873X; Datasheets: http://industrial.panasonic.com/www-cgi/jvcr13pz.cgi?E+PZ+3+AOA0002+ERJ2RKF8873X+7+WW; Image: //media.digikey.com/Photos/Panasonic%20Photos/ERJ-PA2-Series.jpg; Digi-Key Part Number: P887KLCT-ND; Quantity Available: 36244; Packaging: Cut Tape (CT); Series: ERJ; Part Status: Active; Value: 887k; Tolerance: ±1%; Composition: Thick Film; Features: Automotive AEC-Q200; Operating Temperature: -55°C ~ 155°C; Package / Case: 0402 (1005 Metric); Supplier Device Package: 0402; Size / Dimension: 0.039" L x 0.020" W (1.00mm x 0.50mm); Height - Seated (Max): 0.016" (0.40mm); Number of Terminations: 2; Failure Rate: -
R?#16 = ERJ-PA2J105X: RES SMD 1M OHM 5% 1/5W 0402; Manufacturer: Panasonic Electronic Components; Factory Stock: 0; Unit Price (USD): 0.02020; @ qty: 1500; Minimum Quantity: 1; Power (Watts): 0.2W, 1/5W; Temperature Coefficient: ±200ppm/°C; Part Number: ERJ-PA2J105X; Datasheets: https://industrial.panasonic.com/cdbs/www-data/pdf/RDA0000/AOA0000C243.pdf; Image: //media.digikey.com/Photos/Panasonic%20Photos/ERJ-PA2-Series.jpg; Digi-Key Part Number: P17211CT-ND; Quantity Available: 9055; Packaging: Cut Tape (CT); Series: ERJ; Part Status: Active; Value: 1M; Tolerance: ±5%; Composition: Thick Film; Features: Automotive AEC-Q200, Pulse Withstanding; Operating Temperature: -55°C ~ 155°C; Package / Case: 0402 (1005 Metric); Supplier Device Package: 0402; Size / Dimension: 0.039" L x 0.020" W (1.00mm x 0.50mm); Height - Seated (Max): 0.016" (0.40mm); Number of Terminations: 2; Failure Rate: -
U1 = BQ25792RQMR: No Description Available; Mfr_Name: Texas Instruments; Type: DEV; RefDes: RefDes; Copyright: Copyright (C) 2022 Ultra Librarian. All rights reserved.; Manufacturer_Part_Number: BQ25792RQMR
U3 U?#1 = CSD16570Q5B: No Description Available; Mfr_Name: Texas Instruments; Copyright: Copyright (C) 2022 Ultra Librarian. All rights reserved.; Manufacturer_Part_Number: CSD16570Q5B; RefDes: RefDes; Type: DEV
U4 = AUIR3200STR: Integrated Circuit; Manufacturer_Name: Infineon; Datasheet Link: https://componentsearchengine.com/Datasheets/2/AUIR3200STR.pdf; Height: 1.75mm; Manufacturer_Part_Number: AUIR3200STR
U5 = TUSB320IRWBR: No Description Available; Mfr_Name: Texas Instruments; Type: DEV; RefDes: RefDes; Copyright: Copyright (C) 2022 Ultra Librarian. All rights reserved.; Manufacturer_Part_Number: TUSB320IRWBR
U6 = TPS62177DQCR: No Description Available; Mfr_Name: Texas Instruments; Type: DEV; RefDes: RefDes; Copyright: Copyright (C) 2022 Ultra Librarian. All rights reserved.; Manufacturer_Part_Number: TPS62177DQCR
U7 = BQ29209DRBR: Mfr_Name: Texas Instruments; Copyright: Copyright (C) 2022 Ultra Librarian. All rights reserved.; Manufacturer_Part_Number: BQ29209DRBR; RefDes: RefDes; Type: DEV; ComponentLink1Description: Manufacturer_link; ComponentLink1URL: https://www.ti.com/store/ti/en/p/product/?p=BQ29209DRBR
U?#2 = LMR36015SFBRNXR: No Description Available; Mfr_Name: Texas Instruments; Type: DEV; RefDes: RefDes; Copyright: Copyright (C) 2022 Ultra Librarian. All rights reserved.; Manufacturer_Part_Number: LMR36015SFBRNXR
U?#3 = TPD4E05U06DQAR: No Description Available; Mfr_Name: Texas Instruments; CompType: IC; Type: DEV; RefDes: RefDes; Copyright: Copyright (C) 2022 Ultra Librarian. All rights reserved.; Manufacturer_Part_Number: TPD4E05U06DQAR; Application_BuildNumber: *; PartNumber: TPD4E05U06DQAR; PackageReference: DQA0010A; MountType: SMT; RoHS: Y; Manufacturer: Texas Instruments
X1 = XT60PW-M: Socket, DC supply, male, PIN: 2; MF: AMASS; Package: Package; SnapEDA_Link: https://www.snapeda.com/parts/XT60PW-M/AMASS/view-part/?ref=snap; MP: XT60PW-M; Value: *; Availability: Not in stock; Price: None; Check_prices: https://www.snapeda.com/parts/XT60PW-M/AMASS/view-part/?ref=eda
X2 = XT60PW-F: Socket DC Supply Connector Female; MF: AMASS; Availability: Unavailable; SnapEDA_Link: https://www.snapeda.com/parts/XT60PW-F/AMASS/view-part/2890674/?ref=snap; MP: XT60PW-F; Value: *; Price: None; Package: Package
X3 = S3B-XH-A(LF)(SN): Connector Header Through Hole, Right Angle 3 position 0.098 _2.50mm_; MP: S3B-XH-A_LF__SN_; MF: JST Sales; SnapEDA_Link: https://www.snapeda.com/parts/S3B-XH-A%28LF%29%28SN%29/JST%20Sales%20America%20Inc./view-part/46873/?ref=snap; Availability: Unavailable; Package: FakePackage u; Value: *; Price: None
X? = USB4105-GF-A: USB-C (USB TYPE-C) USB 2.0 Receptacle Connector 24 (16+8 Dummy) Position Surface Mount, Right Angle; Through Hole; MF: GCT; Price: None; Value: *; MP: USB4105-GF-A; Package: None; Purchase-URL: https://pricing.snapeda.com/search/part/USB4105-GF-A/?ref=eda; SnapEDA_Link: https://www.snapeda.com/parts/USB4105-GF-A/Global%20Connector%20Technology/view-part/4423780/?ref=snap; Check_prices: https://www.snapeda.com/parts/USB4105-GF-A/Global%20Connector%20Technology/view-part/4423780/?ref=eda; Availability: Warning
RT1 = PRF18AR471QB5RB: Package: None; Price: None; Value: *; MP: PRF18AR471QB5RB; Availability: Unavailable